# EAGLE design PDB2_1 (EAGLE 9.3.0)

## Sheet 1 of 3: BATTERY MANAGEMENT & OUTPUTS
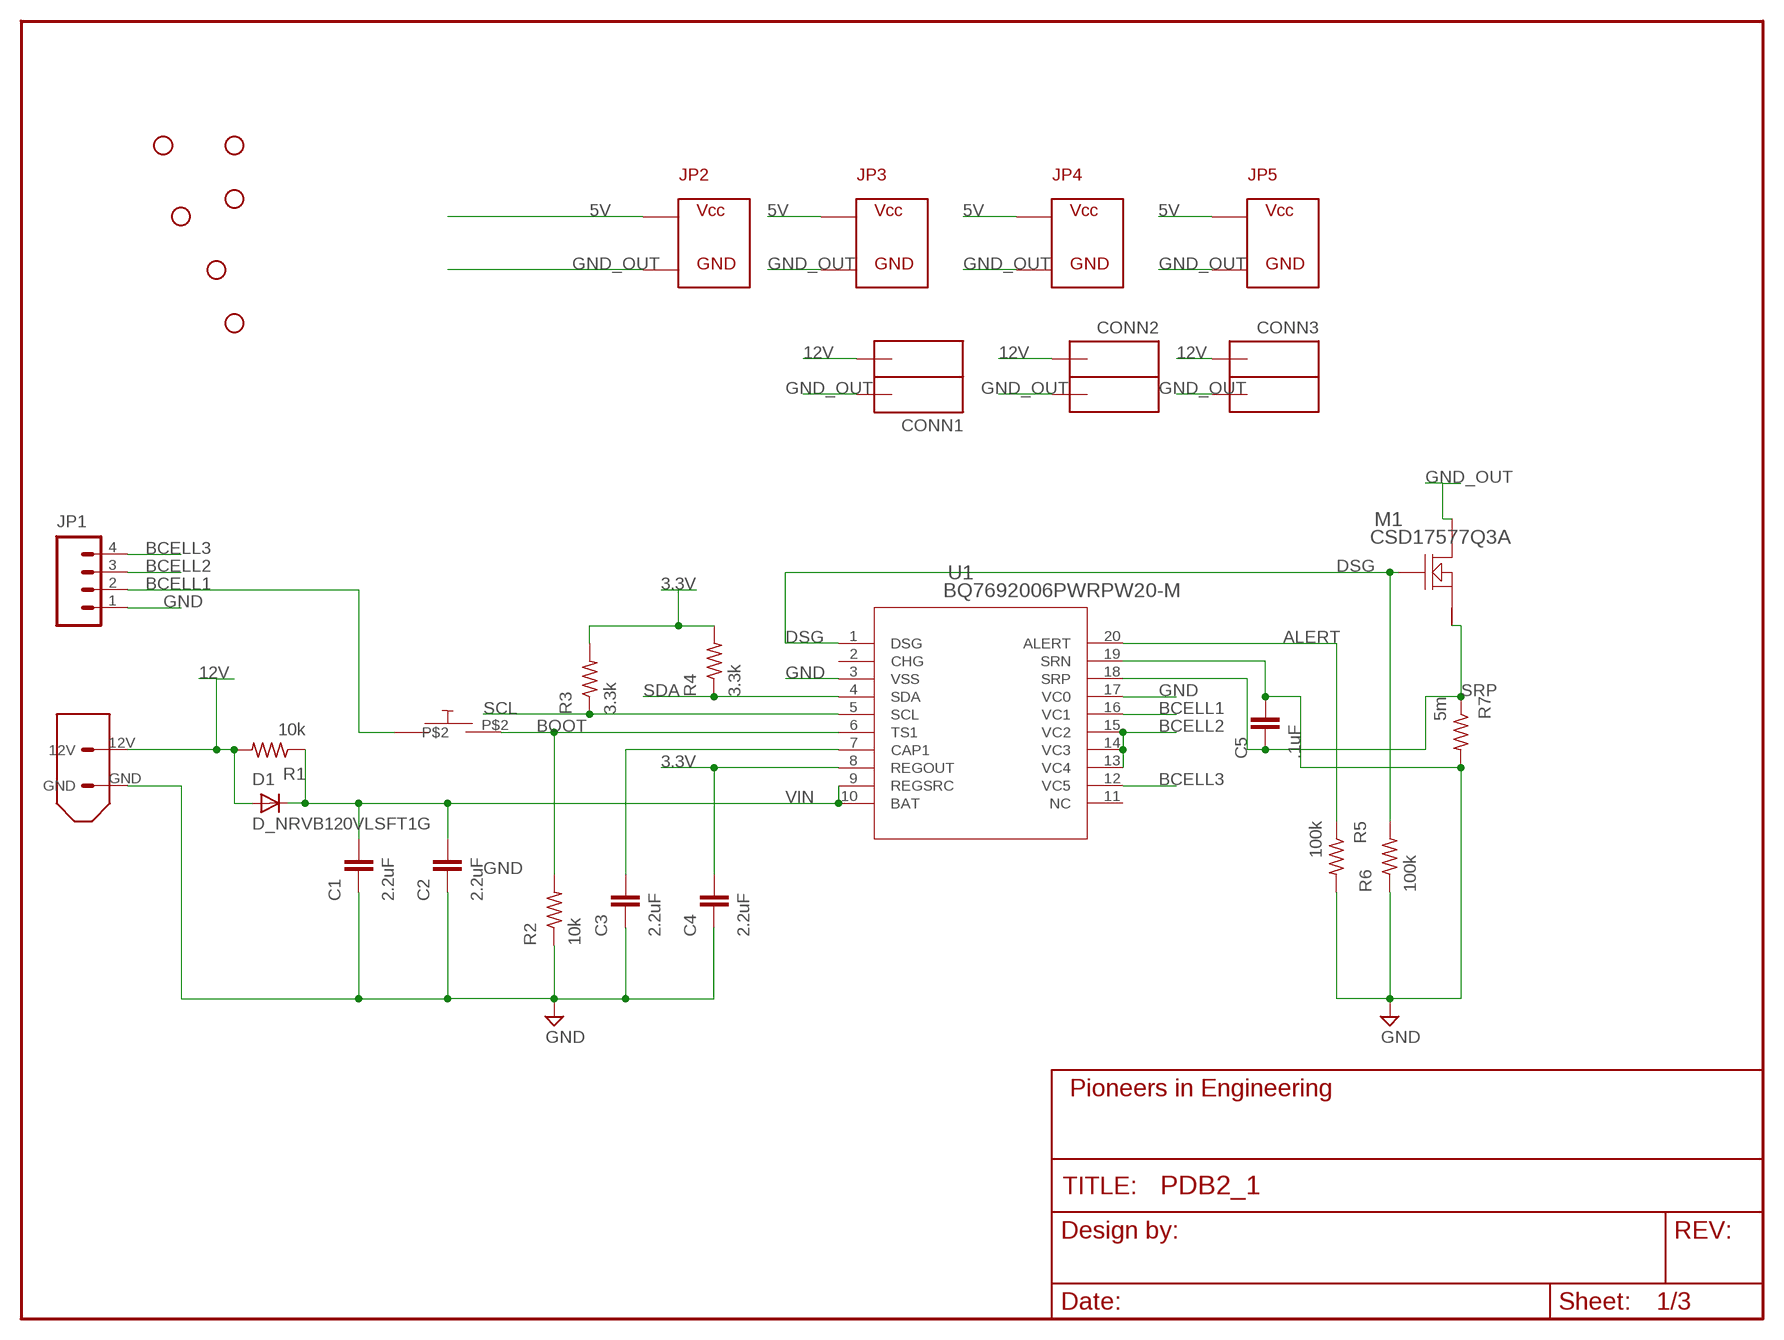
[diagram p0: schematic, sheet 1]
FRAME1 (FRAME_SCHEMATIC): AUTHOR: Sherwin A.

### Parts
C1  2.2uF  CAP0603-CAP  [0603-CAP]
C2  2.2uF  CAP0603-CAP  [0603-CAP]
C3  2.2uF  CAP0603-CAP  [0603-CAP]
C4  2.2uF  CAP0603-CAP  [0603-CAP]
C5  .1uF  CAP0603-CAP  [0603-CAP]
CONN1  ANDERSONVERTICAL  [ANDERSON_VERTICAL]
CONN2  ANDERSONVERTICAL  [ANDERSON_VERTICAL]
CONN3  ANDERSONVERTICAL  [ANDERSON_VERTICAL]
D1  D_NRVB120VLSFT1G  [ON_SEMI_SOD-123F]
J1  XT60CONNECTOR  [XT60CONNECTOR]
JP1  M041X04-MTA  [1X04-MTA]
JP2  ATX  [ATX]
JP3  ATX  [ATX]
JP4  ATX  [ATX]
JP5  ATX  [ATX]
M1  CSD17577Q3A  NMOS_CSD17579Q3A  [DNH0008A]
R1  10k  R-US_R0603  [R0603]
R2  10k  R-US_R0603  [R0603]
R3  3.3k  R-US_R0603  [R0603]
R4  3.3k  R-US_R0603  [R0603]
R5  100k  R-US_R0603  [R0603]
R6  100k  R-US_R0603  [R0603]
R7  5m  R-US_R2512  [R2512]
STANDOFF1  STAND-OFFTIGHT  [STAND-OFF-TIGHT]
STANDOFF2  STAND-OFFTIGHT  [STAND-OFF-TIGHT]
STANDOFF3  STAND-OFFTIGHT  [STAND-OFF-TIGHT]
STANDOFF4  STAND-OFFTIGHT  [STAND-OFF-TIGHT]
STANDOFF5  STAND-OFFTIGHT  [STAND-OFF-TIGHT]
STANDOFF6  STAND-OFFTIGHT  [STAND-OFF-TIGHT]
SW1  PUSH_BUTTON  [BUTTON_K12A]
U1  BQ7692006PWRPW20-M  [PW20-M]

### Nets
3.3V: C4.2 R3.2 R4.2 U1.8(REGOUT) ; also sheet 3
5V: JP2.P$1 JP3.P$1 JP4.P$1 JP5.P$1 ; also sheet 2
12V: CONN1.PIN1(OUTB) CONN2.PIN2(OUTA) CONN3.PIN2(OUTA) D1.P(A) J1.12V R1.2 ; also sheet 2
ALERT: R5.1 U1.20(ALERT) ; also sheet 3
BCELL1: JP1.2 SW1.P$1 U1.16(VC1)
BCELL2: JP1.3 U1.13(VC4) U1.14(VC3) U1.15(VC2)
BCELL3: JP1.4 U1.12(VC5)
BOOT: R2.2 SW1.P$2 U1.6(TS1) ; also sheet 3
CAP1: C3.2 U1.7(CAP1)
DSG: M1.4(GATE) R6.2 U1.1(DSG)
GND: C1.1 C2.1 C3.1 C4.1 C5.2 J1.GND JP1.1 R2.1 R5.2 R6.1 R7.2 U1.3(VSS) U1.17(VC0) U1.19(SRN) ; also sheet 3
GND_OUT: CONN1.PIN2(OUTA) CONN2.PIN1(OUTB) CONN3.PIN1(OUTB) JP2.P$2 JP3.P$2 JP4.P$2 JP5.P$2 M1.5(DRAIN_2) M1.6(DRAIN_2) M1.7(DRAIN_2) M1.8(DRAIN_2) M1.9(DRAIN_2) ; also sheet 2
SCL: R3.1 U1.5(SCL) ; also sheet 3
SDA: R4.1 U1.4(SDA) ; also sheet 3
SRP: C5.1 M1.1(SOURCE_2) M1.2(SOURCE_2) M1.3(SOURCE_2) R7.1 U1.18(SRP)
VIN: C1.2 C2.2 D1.N(C) R1.1 U1.9(REGSRC) U1.10(BAT)
Unconnected: U1.2(CHG) U1.11(NC)

## Sheet 2 of 3: VOLTAGE REGULATOR
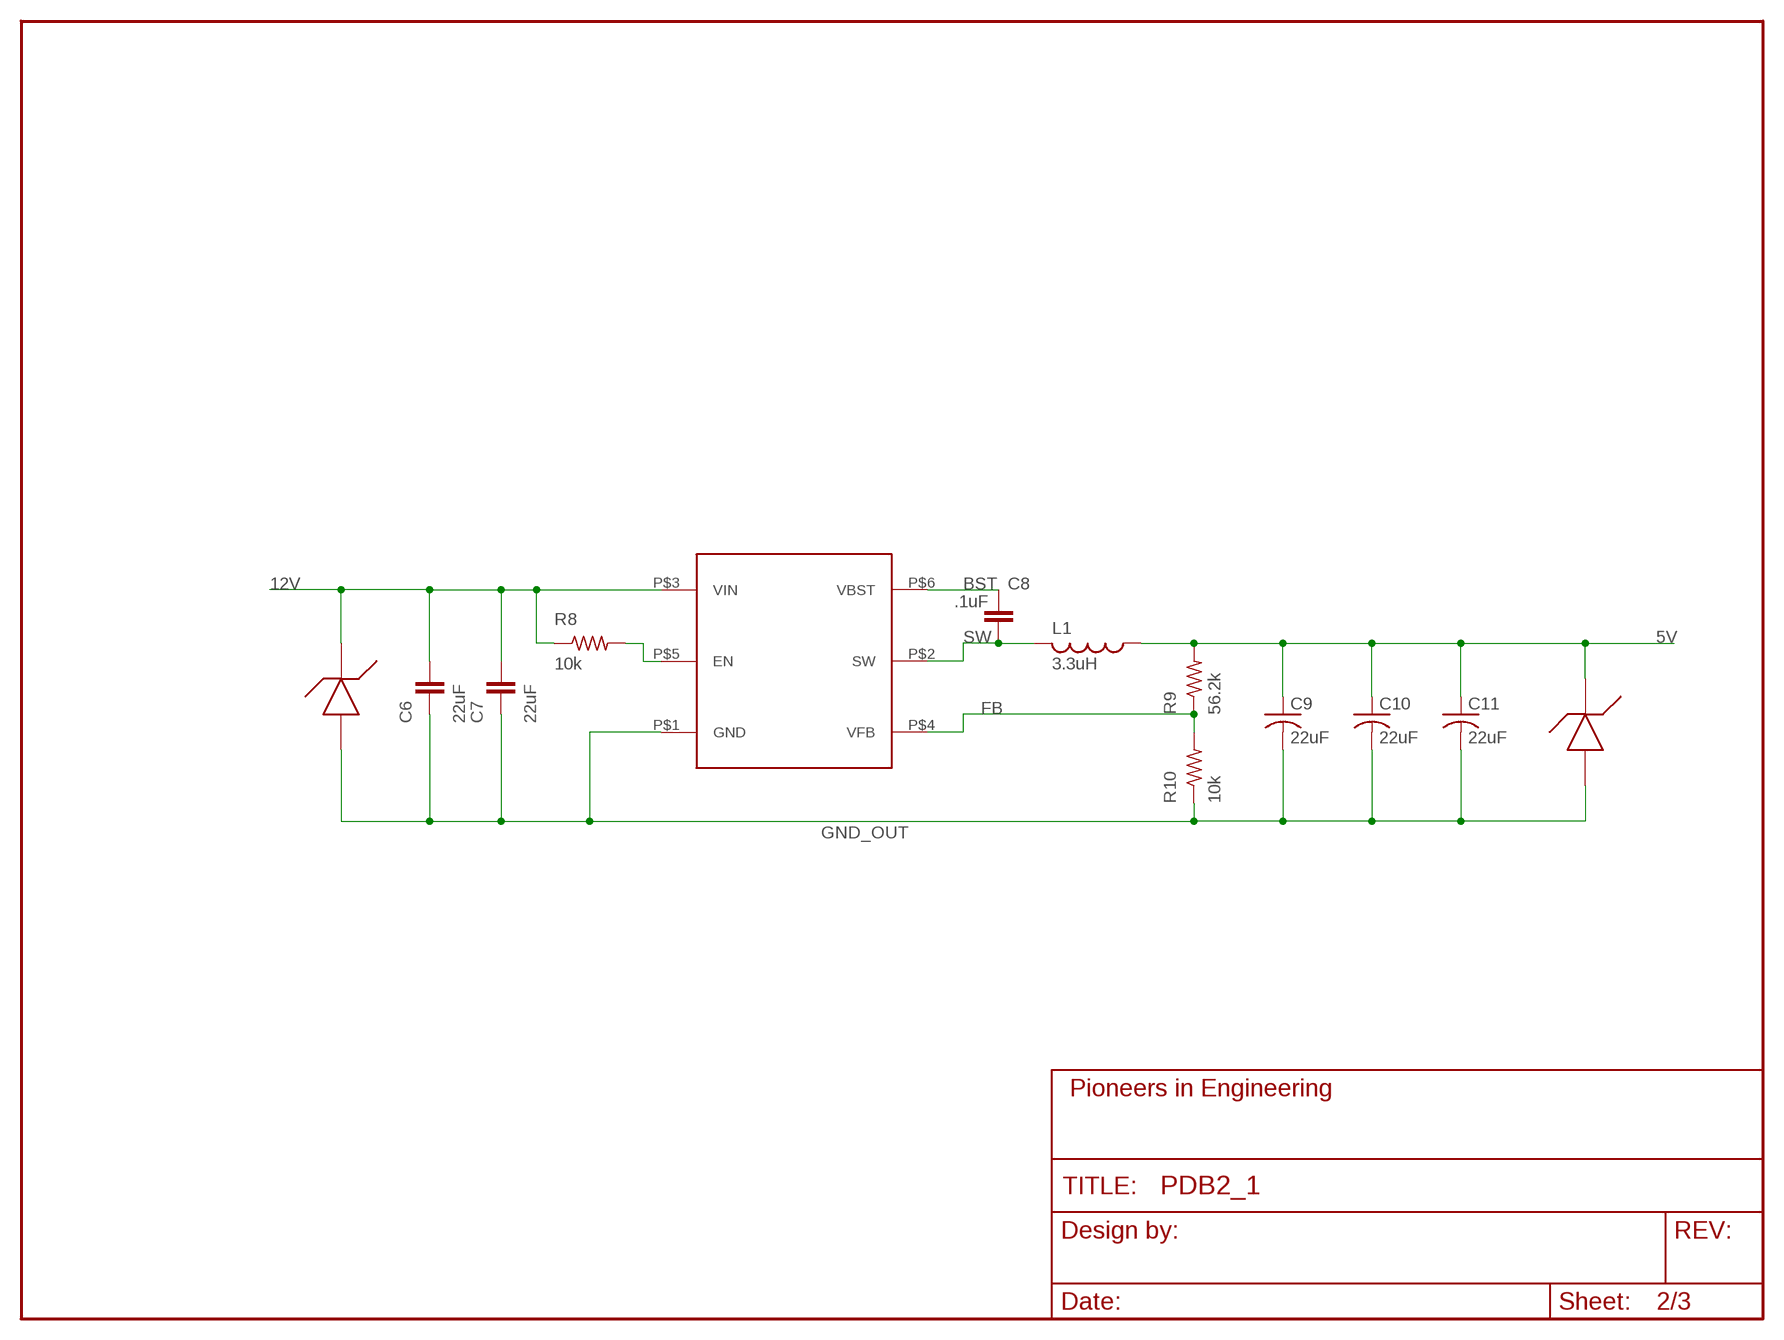
[diagram p1: schematic, sheet 2]

### Parts
C6  22uF  CAP0805  [0805]
C7  22uF  CAP0805  [0805]
C8  .1uF  CAP0603-CAP  [0603-CAP]
C9  22uF  C-USC0805  [C0805]
C10  22uF  C-USC0805  [C0805]
C11  22uF  C-USC0805  [C0805]
D2  BZT52C2VXX_ZENER  [SOD-123]
D3  BZT52C2VXX_ZENER  [SOD-123]
L1  3.3uH  MWSA0420S_INDUCTORMW  [MWSA0402S]
R8  10k  R-US_R0603  [R0603]
R9  56.2k  R-US_R0603  [R0603]
R10  10k  R-US_R0603  [R0603]
U2  TPS563200  [SOT-23_6PIN_COPY]

### Nets
5V: C9.1 C10.1 C11.1 D3.N L1.P$1 R9.2 ; also sheet 1
12V: C6.2 C7.2 D2.N R8.1 U2.P$3(VIN) ; also sheet 1
BST: C8.1 U2.P$6(VBST)
FB: R9.1 R10.2 U2.P$4(VFB)
GND_OUT: C6.1 C7.1 C9.2 C10.2 C11.2 D2.P D3.P R10.1 U2.P$1(GND) ; also sheet 1
N$27: R8.2 U2.P$5(EN)
SW: C8.2 L1.P$2 U2.P$2(SW)

## Sheet 3 of 3: DIGITAL INTERFACE
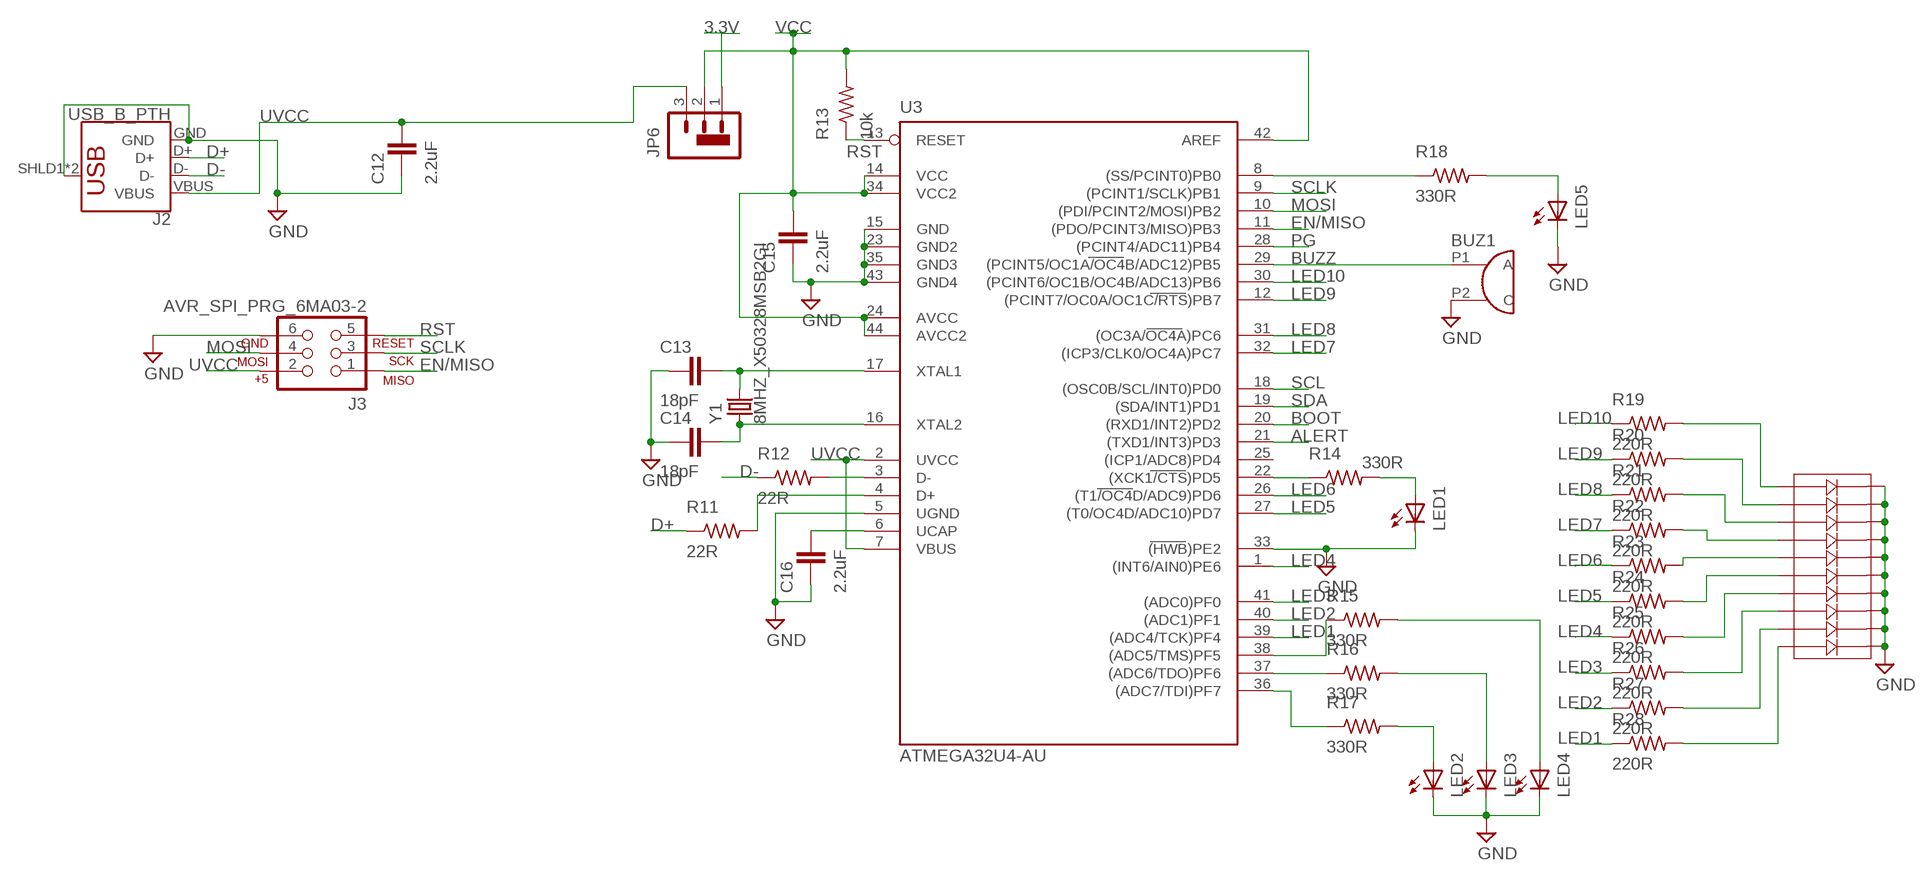
[diagram p2: schematic, sheet 3]

### Parts
BUZ1  BUZZER3.3VBUZZER  [BUZZER_3.3V]
C12  2.2uF  CAP0603-CAP  [0603-CAP]
C13  18pF  CAP0603-CAP  [0603-CAP]
C14  18pF  CAP0603-CAP  [0603-CAP]
C15  2.2uF  CAP0603-CAP  [0603-CAP]
C16  2.2uF  CAP0603-CAP  [0603-CAP]
J2  USB_B_PTH  [USB-B-PTH]
J3  AVR_SPI_PRG_6MA03-2  [MA03-2]
JP6  JMP-OPTION  [1X03-JMP-OPTION]
LED1  LED0805  [LED-0805]
LED2  LED0805  [LED-0805]
LED3  LED0805  [LED-0805]
LED4  LED0805  [LED-0805]
LED5  LED0805  [LED-0805]
LED6  BAR_SEGMENT_DISPLAY  [BAR_SEGMENT_DISPLAY]
R11  22R  R-US_R0603  [R0603]
R12  22R  R-US_R0603  [R0603]
R13  10k  R-US_R0603  [R0603]
R14  330R  R-US_R0603  [R0603]
R15  330R  R-US_R0603  [R0603]
R16  330R  R-US_R0603  [R0603]
R17  330R  R-US_R0603  [R0603]
R18  330R  R-US_R0603  [R0603]
R19  220R  R-US_R0603  [R0603]
R20  220R  R-US_R0603  [R0603]
R21  220R  R-US_R0603  [R0603]
R22  220R  R-US_R0603  [R0603]
R23  220R  R-US_R0603  [R0603]
R24  220R  R-US_R0603  [R0603]
R25  220R  R-US_R0603  [R0603]
R26  220R  R-US_R0603  [R0603]
R27  220R  R-US_R0603  [R0603]
R28  220R  R-US_R0603  [R0603]
U3  ATMEGA32U4-AU  [TQFP44]
Y1  8MHZ_X50328MSB2GI  [SMD-5032_2P]

### Nets
3.3V: JP6.1 ; also sheet 1
ALERT: U3.21((TXD1/INT3)PD3) ; also sheet 1
BOOT: U3.20((RXD1/INT2)PD2) ; also sheet 1
BUZZ: BUZ1.P1(A) U3.29((PCINT5/OC1A/OC4B/ADC12)PB5)
D+: J2.D+ R11.1
D-: J2.D- R12.1
EN/MISO: J3.1 U3.11((PDO/PCINT3/MISO)PB3)
GND: BUZ1.P2(C) C12.1 C13.1 C14.1 C15.1 C16.1 J2.GND J2.SHLD1(SHIELD) J2.SHLD2(SHIELD) J3.6 LED1.C LED2.C LED3.C LED4.C LED5.C LED6.BAR_DISPLAY10(P11) LED6.BAR_DISPLAY11(P12) LED6.BAR_DISPLAY12(P13) LED6.BAR_DISPLAY13(P14) LED6.BAR_DISPLAY14(P15) LED6.BAR_DISPLAY15(P16) LED6.BAR_DISPLAY16(P17) LED6.BAR_DISPLAY17(P18) LED6.BAR_DISPLAY18(P19) LED6.BAR_DISPLAY19(P20) U3.5(UGND) U3.15(GND) U3.23(GND2) U3.33((HWB)PE2) U3.35(GND3) U3.43(GND4) ; also sheet 1
LED1: R28.1 U3.39((ADC4/TCK)PF4)
LED2: R27.1 U3.40((ADC1)PF1)
LED3: R26.1 U3.41((ADC0)PF0)
LED4: R25.1 U3.1((INT6/AIN0)PE6)
LED5: R24.1 U3.27((T0/OC4D/ADC10)PD7)
LED6: R23.1 U3.26((T1/OC4D/ADC9)PD6)
LED7: R22.1 U3.32((ICP3/CLK0/OC4A)PC7)
LED8: R21.1 U3.31((OC3A/OC4A)PC6)
LED9: R20.1 U3.12((PCINT7/OC0A/OC1C/RTS)PB7)
LED10: R19.1 U3.30((PCINT6/OC1B/OC4B/ADC13)PB6)
MOSI: J3.4 U3.10((PDI/PCINT2/MOSI)PB2)
N$2: C13.2 U3.17(XTAL1) Y1.P$2
N$3: R12.2 U3.3(D-)
N$4: R11.2 U3.4(D+)
N$5: C14.2 U3.16(XTAL2) Y1.P$1
N$8: C16.2 U3.6(UCAP)
N$12: LED6.BAR_DISPLAY0(P1) R19.2
N$13: LED6.BAR_DISPLAY1(P2) R20.2
N$14: LED6.BAR_DISPLAY2(P3) R21.2
N$15: LED6.BAR_DISPLAY3(P4) R22.2
N$16: LED6.BAR_DISPLAY4(P5) R23.2
N$17: LED6.BAR_DISPLAY5(P6) R24.2
N$18: LED6.BAR_DISPLAY6(P7) R25.2
N$19: LED6.BAR_DISPLAY7(P8) R26.2
N$20: LED6.BAR_DISPLAY8(P9) R27.2
N$21: LED6.BAR_DISPLAY9(P10) R28.2
N$22: R18.1 U3.8((SS/PCINT0)PB0)
N$23: LED5.A R18.2
N$24: LED1.A R14.2
N$25: R14.1 U3.22((XCK1/CTS)PD5)
N$28: R17.1 U3.36((ADC7/TDI)PF7)
N$29: R16.1 U3.37((ADC6/TDO)PF6)
N$30: R15.1 U3.38((ADC5/TMS)PF5)
N$31: LED2.A R17.2
N$32: LED3.A R16.2
N$33: LED4.A R15.2
PG: U3.28((PCINT4/ADC11)PB4)
RST: J3.5 R13.1 U3.13(RESET)
SCL: U3.18((OSC0B/SCL/INT0)PD0) ; also sheet 1
SCLK: J3.3 U3.9((PCINT1/SCLK)PB1)
SDA: U3.19((SDA/INT1)PD1) ; also sheet 1
UVCC: C12.2 J2.VBUS J3.2 JP6.3 U3.2(UVCC) U3.7(VBUS)
VCC: C15.2 JP6.2(COMMON) R13.2 U3.14(VCC) U3.24(AVCC) U3.34(VCC2) U3.42(AREF) U3.44(AVCC2)
Unconnected: U3.25((ICP1/ADC8)PD4)

## Library data of the parts
BUZ1 = pie:BUZZER: Buzzer
C1-C8 C12-C16 = pie:CAP: Capacitor Standard 0603 ceramic capacitor, and 0.1" leaded capacitor.; PIE-INT-REF-NUM: CAPACITOR-GENERIC
C9-C11 = resistor:C-US: CAPACITOR, American symbol
CONN1-CONN3 = pie:ANDERSON: 2-pin 25A Anderson Connector http://www.alliedelec.com/images/products/datasheets/bm/ANDERSON_POWER_PRODUCTS/70162018.pdf; PIE-INT-REF-NUM: Anderson
D1 = pie:D_NRVB120VLSFT1G
D2 D3 = pie:BZT52C2VXX_ZENER
J1 = pie:XT60CONNECTOR: 12V XT60 power connector; PARTNUMBER: PRT-10474
J2 = SparkFun-Connectors:USB_B: USB Type B Connector SparkFun Products: SparkFun Stepoko <https://www.sparkfun.com/products/13899> PTH; PROD_ID: CONN-08278; SF_ID: PRT-00139
J3 = pie:AVR_SPI_PRG_6: AVR ISP 6 Pin This is the reduced ISP connector for AVR programming. Common on Arduino. This footprint will take up less PCB space and can be used with a 10-pin to 6-pin adapter such as SKU: BOB-08508; PIE-INT-REF-NUM: BULK-STOCK
JP1 = pie:M04: 4-pin 0.1-inch header and MTA connector; PIE-INT-REF-NUM: MTA
JP2-JP5 = pie:ATX: ATX 2 Pin Connector Crimper: http://www.digikey.com/product-detail/en/molex-llc/0640160204/WM17553-ND/2074099 Housing: http://www.digikey.com/product-detail/en/molex-llc/0019092029/WM4382-ND/2421313 Housing (alternative): http://www.digikey.com/product-detail/en/molex-llc/0015311026/WM1041-ND/313614 Connector: http://www.digikey.com/product-detail/en/molex-llc/0019091029/WM1602-ND/26354 Male crimps: http://www.digikey.com/product-detail/en/molex-llc/0002092103/WM1100-ND/26384 Female crimps: http://www.digikey.com/product-detail/en/molex-llc/0002091104/WM1101-ND/26386
JP6 = pie:JMP-OPTION: A 3 pin header with silk screen indicating jumper positions to select an option.
L1 = pie:MWSA0420S_INDUCTOR
LED1-LED5 = pie:LED: LEDs Standard schematic elements and footprints for 5mm, 3mm, 1206, and 0603 sized LEDs. 5mm - Spark Fun Electronics SKU : COM-00529 (and others); PIE-INT-REF-NUM: LED
LED6 = pie:BAR_SEGMENT_DISPLAY
M1 = pie:NMOS_CSD17579Q3A; MANUFACTURER_PART_NUMBER: CSD17577Q3A; VENDOR: Texas Instruments
R1-R6 R8-R28 = pie:R-US_: RESISTOR, American symbol; DESCRIPTION: RESISTOR, American symbol; DISTRIBUTOR: DigiKey; MANUFACTURER: Rohm Semiconductor; NOTES: Cut Tape; PACKAGE: R0603; VALUE: >VALUE
R7 = pie:R-US_: RESISTOR, American symbol; PIE-INT-REF-NUM: RESISTOR-GENERIC
STANDOFF1-STANDOFF6 = pie:STAND-OFF: #4 Stand Off This is the mechanical footprint for a #4 phillips button head screw. Use the keepout ring to avoid running the screw head into surrounding components. SKU : PRT-00447; PIE-INT-REF-NUM: DNL
SW1 = pie:PUSH_BUTTON
U1 = pie:BQ7692006PWR; MANUFACTURER_PART_NUMBER: BQ7692006PWR; VENDOR: Texas Instruments
U2 = pie:TPS563200
U3 = pie:ATMEGA32U4-AU; PIE-DIGIKEY-PN-ALT1: ATMEGA32U4-MURCT-ND; PIE-DIGIKEY-PN-PRI: ATMEGA32U4RC-MURCT-ND; PIE-INT-REF-NUM: ATmega32U4
Y1 = pie:8MHZ_X50328MSB2GI

## Board
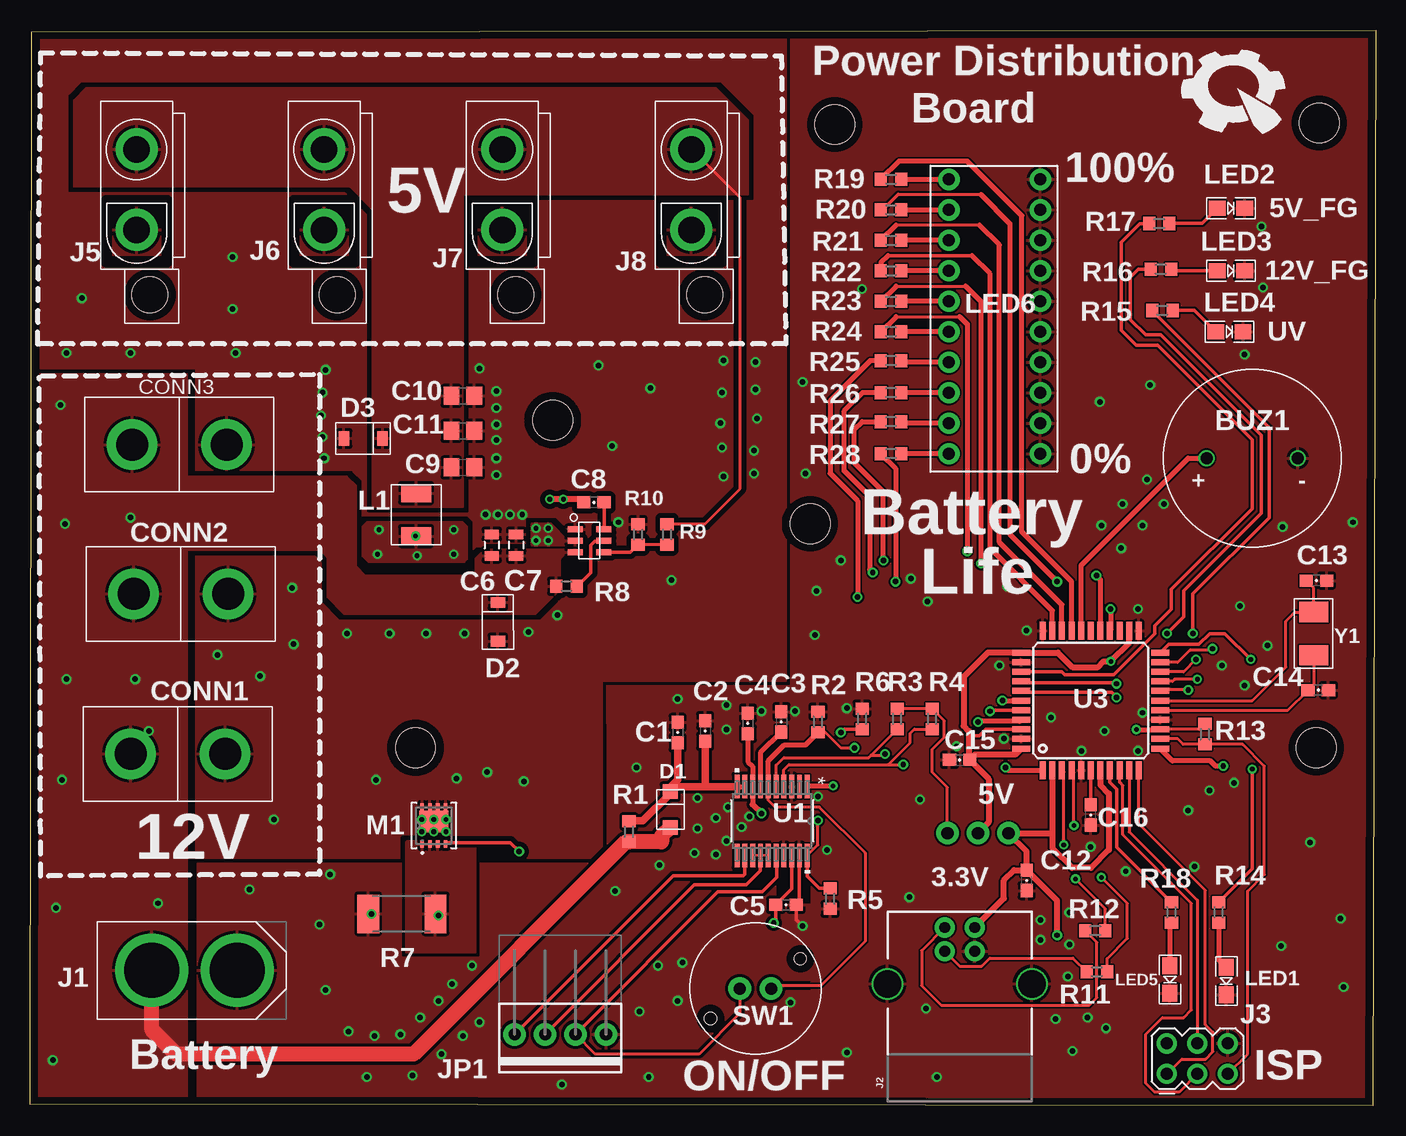
[diagram p3: board, top side]
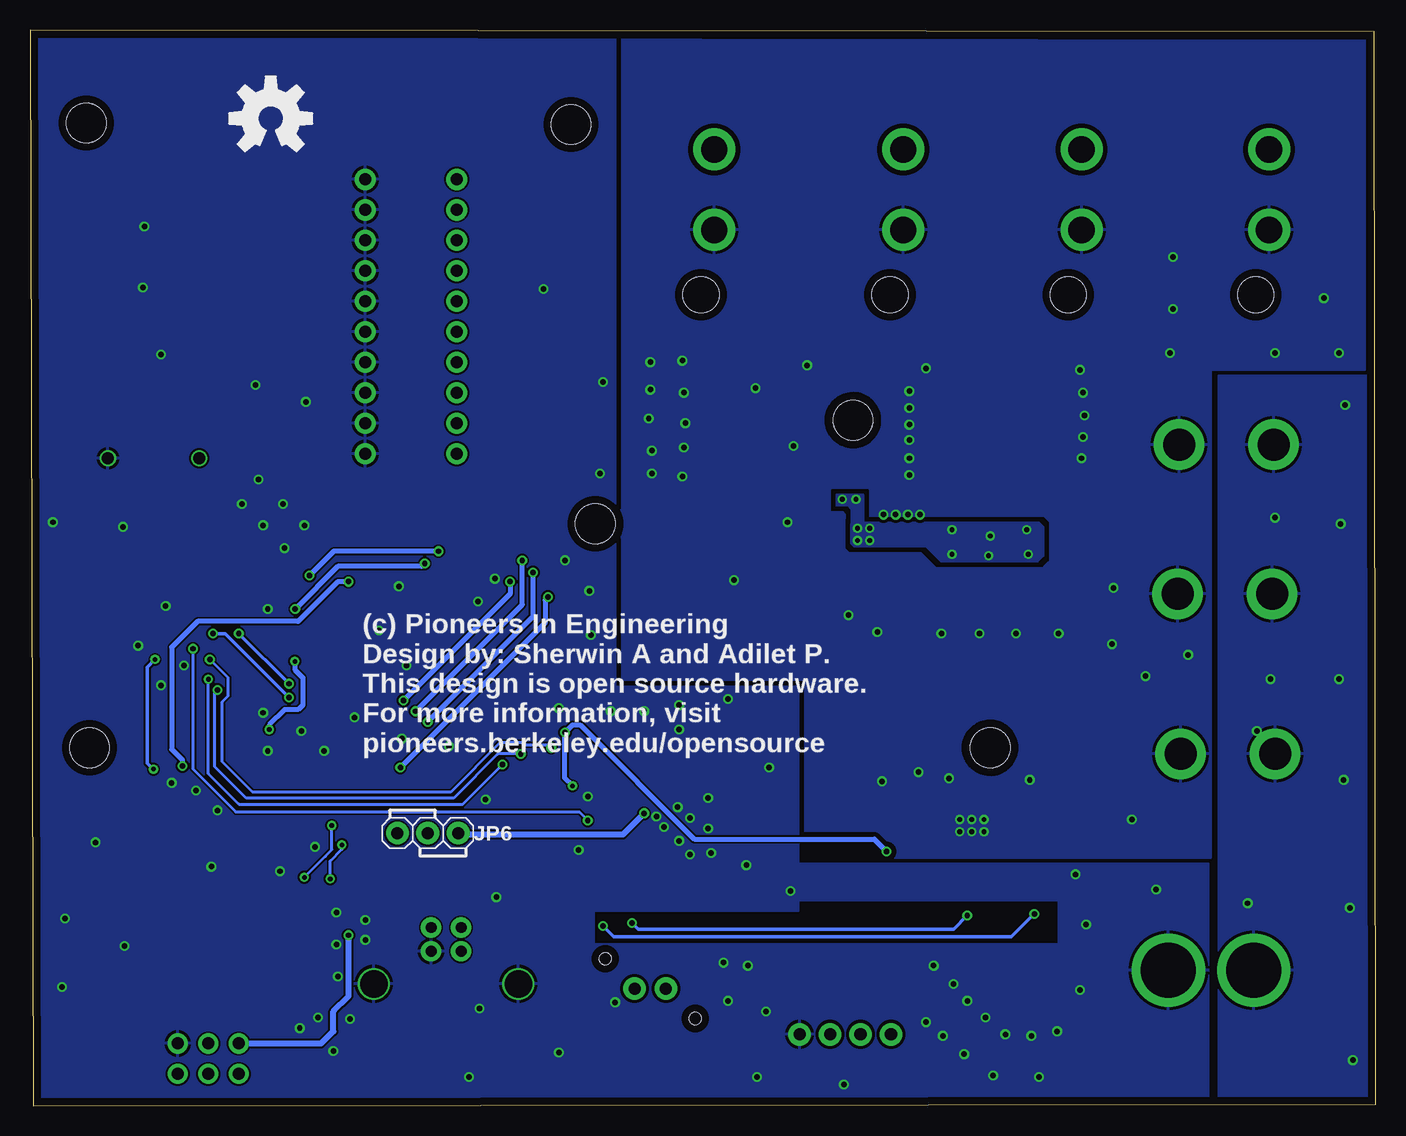
[diagram p4: board, bottom side, seen from below]

Size 112.14 x 89.66 mm. Coordinates in mm from the lower left corner, seen from the top.
Outline: 0,0.13 0.13,89.54 112.14,89.66 111.89,0 0,0.13
Copper layers (1*16): Top 2mil / dielectric 9mil / Bottom 2mil
Design rules "pie": minimum track width 6mil, minimum drill 15mil, track to track 6mil, track to pad 6mil, pad to pad 6mil, via to via 6mil, smd to smd 6mil, copper to edge 25mil, drill to drill 7mil, minimum pad ring 7mil, minimum via ring 7mil, stop-mask expansion 3mil, vias tented up to drill 21mil, thermal gap 10mil

### Footprints (pad centres in the part's own frame; a part is rotated, then mirrored left to right if it is on the bottom)
BUZZER_3.3V = drill 1: P1 -3.81,0; P2 3.79,0
0603-CAP = smd 1.1 x 1: 1 -0.85,0; 2 0.85,0
0805 = smd 0.8 x 1.2: 1 -0.9,0; 2 0.9,0
C0805 = smd 1.3 x 1.5: 1 -0.95,0; 2 0.95,0
ANDERSON_VERTICAL = drill 2.667 pad 4.191: PIN1 0,-3.937; PIN2 0,3.937
ON_SEMI_SOD-123F = smd 1.22 x 1.25: N -1.557,0; P 1.443,0
SOD-123 = smd 0.9 x 1.22: N -1.57,0; P 1.65,0
XT60CONNECTOR = drill 4.572 pad 6.096: 12V -3.556,0; GND 3.556,0
USB-B-PTH = drill 0.914 pad 1.676: D+ 4,1.25; D- 5.981,1.25; GND 4,-1.25; VBUS 5.981,-1.25 | drill 2.286: SHLD1 1.282,-6.02; SHLD2 1.282,6.02
MA03-2 = drill 1 pad 1.676: 1 -2.54,-1.27; 2 -2.54,1.27; 3 0,-1.27; 4 0,1.27; 5 2.54,-1.27; 6 2.54,1.27
1X04-MTA = drill 1.016 pad 1.88: 1 -3.81,0; 2 -1.27,0; 3 1.27,0; 4 3.81,0
ATX = drill 2.2 pad 3.5: P$1 -3,0; P$2 3.7,0 | hole 3: 9.1,1.1
1X03-JMP-OPTION = drill 1.016 pad 1.88: 1 -2.54,0; 2 0,0; 3 2.54,0
MWSA0402S = smd 1.5 x 2.5: P$1 -1.8,-0.2; P$2 1.8,-0.2
LED-0805 = smd 1.397 x 1.245: A -1.143,0; C 1.143,0
BAR_SEGMENT_DISPLAY = drill 1 pad 1.778: BAR_DISPLAY0 -3.429,9.652; BAR_DISPLAY1 -3.429,7.112; BAR_DISPLAY2 -3.429,4.572; BAR_DISPLAY3 -3.429,2.032; BAR_DISPLAY4 -3.429,-0.508; BAR_DISPLAY5 -3.429,-3.048; BAR_DISPLAY6 -3.429,-5.588; BAR_DISPLAY7 -3.429,-8.128; BAR_DISPLAY8 -3.429,-10.668; BAR_DISPLAY9 -3.429,-13.208; BAR_DISPLAY10 4.191,-13.208; BAR_DISPLAY11 4.191,-10.668; BAR_DISPLAY12 4.191,-8.128; BAR_DISPLAY13 4.191,-5.588; BAR_DISPLAY14 4.191,-3.048; BAR_DISPLAY15 4.191,-0.508; BAR_DISPLAY16 4.191,2.032; BAR_DISPLAY17 4.191,4.572; BAR_DISPLAY18 4.191,7.112; BAR_DISPLAY19 4.191,9.652
DNH0008A = smd 0.61 x 0.305: 1 -1.55,0.975; 2 -1.55,0.325; 3 -1.55,-0.325; 4 -1.55,-0.975 | smd 0.635 x 0.305: 5 1.55,-0.975; 6 1.55,-0.325; 7 1.55,0.325; 8 1.55,0.975 | smd 1.778 x 2.438: 9 0.343,0
R0603 = smd 1 x 1.1: 1 -0.85,0; 2 0.85,0
R2512 = smd 1.8 x 3.2: 1 -2.8,0; 2 2.8,0
STAND-OFF-TIGHT = hole 3.302: 0,0
BUTTON_K12A = drill 1 pad 1.88: P$1 -1.308,0; P$2 1.303,0 | hole 1: -3.747,-2.489; 3.747,2.489
PW20-M = smd 1.981 x 0.406: 1 -2.87,2.925; 2 -2.87,2.275; 3 -2.87,1.625; 4 -2.87,0.975; 5 -2.87,0.325; 6 -2.87,-0.325; 7 -2.87,-0.975; 8 -2.87,-1.625; 9 -2.87,-2.275; 10 -2.87,-2.925; 11 2.87,-2.925; 12 2.87,-2.275; 13 2.87,-1.625; 14 2.87,-0.975; 15 2.87,-0.325; 16 2.87,0.325; 17 2.87,0.975; 18 2.87,1.625; 19 2.87,2.275; 20 2.87,2.925
SOT-23_6PIN_COPY = smd 0.5 x 1.25: P$1 0.6,-0.3; P$2 1.55,-0.3; P$3 2.5,-0.3; P$4 2.5,2.1; P$5 1.55,2.1; P$6 0.6,2.1
TQFP44 = smd 1.5 x 0.5: 1 -5.8,4; 2 -5.8,3.2; 3 -5.8,2.4; 4 -5.8,1.6; 5 -5.8,0.8; 6 -5.8,0; 7 -5.8,-0.8; 8 -5.8,-1.6; 9 -5.8,-2.4; 10 -5.8,-3.2; 11 -5.8,-4; 23 5.8,-4; 24 5.8,-3.2; 25 5.8,-2.4; 26 5.8,-1.6; 27 5.8,-0.8; 28 5.8,0; 29 5.8,0.8; 30 5.8,1.6; 31 5.8,2.4; 32 5.8,3.2; 33 5.8,4 | smd 0.5 x 1.5: 12 -4,-5.8; 13 -3.2,-5.8; 14 -2.4,-5.8; 15 -1.6,-5.8; 16 -0.8,-5.8; 17 0,-5.8; 18 0.8,-5.8; 19 1.6,-5.8; 20 2.4,-5.8; 21 3.2,-5.8; 22 4,-5.8; 34 4,5.8; 35 3.2,5.8; 36 2.4,5.8; 37 1.6,5.8; 38 0.8,5.8; 39 0,5.8; 40 -0.8,5.8; 41 -1.6,5.8; 42 -2.4,5.8; 43 -3.2,5.8; 44 -4,5.8
SMD-5032_2P = smd 1.7 x 2.4: P$1 -1.8,0; P$2 1.8,0

### Placement (x,y rotation side)
BUZ1  101.85,53.97 0 top
C1  53.97,31.12 270 top
C2  56.26,31.24 270 top
C3  62.61,32 270 top
C4  59.82,31.88 270 top
C5  62.99,16.76 0 top
C6  38.48,46.74 270 top
C7  40.51,46.74 270 top
C8  46.99,50.29 180 top
C9  36.07,53.21 0 top
C10  36.07,59.18 0 top
C11  36.07,56.26 0 top
C12  83.06,18.8 90 top
C13  107.2,43.78 180 top
C14  107.36,34.66 180 top
C15  77.47,28.83 0 top
C16  88.39,24.26 90 top
CONN1  12.32,29.34 270 top
CONN2  12.57,42.67 90 top
CONN3  12.45,55.12 90 top
D1  53.34,24.64 270 top
D2  38.99,40.39 270 top
D3  27.81,55.63 180 top
J1  13.72,11.3 0 top
J2  77.47,8.89 90 top
J3  97.28,3.94 0 top
JP1  44.2,5.97 180 top
JP2  55.12,76.71 270 top
JP3  8.89,76.71 270 top
JP4  39.37,76.71 270 top
JP5  24.51,76.71 270 top
JP6  78.99,22.73 180 bottom
L1  32.38,49.28 270 top
LED1  99.7,10.41 270 top
LED2  100.08,74.8 0 top
LED3  100.08,69.6 0 top
LED4  99.95,64.52 0 top
LED5  95,10.54 270 top
LED6  80.01,67.56 0 top
M1  33.65,23.37 90 top
R1  49.91,22.86 270 top
R2  65.66,32 270 top
R3  72.26,32.26 90 top
R4  75.18,32.26 90 top
R5  66.68,17.27 270 top
R6  69.34,32.26 270 top
R7  30.99,16 180 top
R8  44.7,43.31 0 top
R9  53.09,47.62 90 top
R10  50.67,47.62 270 top
R11  88.9,11.18 0 top
R12  88.77,14.61 0 top
R13  97.92,30.99 90 top
R14  99.06,16.13 270 top
R15  94.36,66.29 0 top
R16  94.23,69.72 0 top
R17  94.11,73.53 0 top
R18  95.12,16.13 270 top
R19  71.76,77.22 0 top
R20  71.76,74.68 0 top
R21  71.76,72.14 0 top
R22  71.76,69.6 0 top
R23  71.76,67.06 0 top
R24  71.76,64.52 0 top
R25  71.76,62.1 0 top
R26  71.76,59.44 0 top
R27  71.76,57.02 0 top
R28  71.76,54.36 0 top
STANDOFF1  32.13,29.85 0 top
STANDOFF2  107.19,29.85 0 top
STANDOFF3  67.06,81.79 0 top
STANDOFF4  107.44,81.92 0 top
STANDOFF5  43.56,57.15 0 top
STANDOFF6  65.02,48.51 0 top
SW1  60.45,9.78 0 top
U1  61.85,23.75 270 top
U2  45.72,48.64 270 top
U3  88.39,33.78 90 top
U$1  [PIE-LOGO-SMALL]  100.58,84.84 0 top
U$2  [OSHW-LOGO-L]  92.08,82.3 0 bottom
Y1  106.97,39.35 90 top

### Tracks (layer width: path | path; a pad name or v marks a point on that pad's centre or on a via)
3.3V  (via drill 0.46 pad 0.76)
  Top 0.254: R3.2 R4.2 76.2,32.09 76.2,30.73 75.18,29.72 75.18,27.81 76.45,26.54 JP6.1
  Top 0.406: C4.2 59.82,28.7 60.22,28.3 U1.8 60.22,25.12
  Top 0.508: 60.22,25.12 v60.96,24.38
  Bottom 0.508: v60.96,24.38 62.74,22.61 76.33,22.61 JP6.1
5V
  Top 0.254: R9.2 53.12,48.51 56.26,48.51 59.18,51.43 59.18,75.69 55.17,79.71 JP2.P$1
  pour Top (isolate 0.254): 28.58,49.91 28.58,74.68 26.67,76.58 3.68,76.58 3.68,83.82 4.7,84.84 57.15,84.84 59.82,82.17 59.82,75.95 36.06,75.95 36.06,53.59 36.07,53.59 36.07,49.91
12V  (via drill 0.46 pad 0.76)
  Top 1.27: J1.12V 10.16,6.35 12.19,4.32 31.96,4.32 49.66,22.01 R1.2 52.64,22.01 52.64,22.5 D1.P
  other vias: 1.91,3.81 2.16,16.51 2.67,27.18 3.05,35.56 9.91,31.24 10.67,16.89 8.76,35.56 2.92,48.51 8.38,49.02 2.54,58.42
  pour Top (isolate 0.254, rank 2): -3.3,60.96 -3.3,-2.03 13.08,-2.03 13.08,60.96
  pour Bottom (isolate 0.254, rank 2): -3.94,60.83 13.08,60.83 13.08,-2.29 -3.94,-2.29
  pour Top: 12.19,52.45 12.19,46.74 12.57,46.35 24.13,46.35 24.77,45.72 24.77,42.42 26.16,41.02 42.16,41.02 44.2,43.05 44.2,45.59 44.58,45.97 45.72,45.97 45.72,46.35 37.85,46.35 37.08,45.59 37.08,44.2 27.94,44.2 27.18,44.96 27.18,51.69 26.42,52.45
ALERT  (via drill 0.45 pad 0.76)
  Top 0.254: U1.20 65.66,21.76 v65.66,23.8 | v98.55,38.1 98.43,37.97 96.65,37.97 95.63,36.96 94.22,36.96 U3.21
  Top 0.305: U1.20 64.77,19.13 65.79,18.12 R5.1
  Bottom 0.254: v65.66,23.8 66.37,24.51 95,24.51 98.55,28.07 v98.55,38.1
BCELL1
  Top 0.254: SW1.P$1 59.14,7.71 55.75,4.32 47.12,4.32 JP1.2
  Top 0.305: JP1.2 57.33,17.83 61.01,17.83 62.23,19.05 62.23,20.82 U1.16
BCELL2
  Top 0.203: U1.13 U1.14 U1.15
  Top 0.305: JP1.3 55.37,18.42 59.69,18.42 60.87,19.6 U1.14
BCELL3
  Top 0.305: JP1.4 53.59,19.18 59.44,19.18 59.57,19.32 U1.12
BOOT  (via drill 0.45 pad 0.76)
  Top 0.254: U1.6 61.52,25.47 62.1,24.89 65.79,24.89 69.6,21.08 69.6,13.72 65.91,10.03 62.01,10.03 SW1.P$2 | R2.2 66.26,31.15 67.56,29.85 v68.71,29.85 | v97.16,37.21 96.13,36.18 U3.20
  Top 0.406: U1.6 61.52,28.76 62.86,30.1 64.64,30.1 65.66,31.12 R2.2
  Bottom 0.254: v68.71,29.85 68.96,30.1 71.04,30.1 71.22,30.27 72.98,30.27 77.09,26.16 93.6,26.16 96.11,28.68 96.11,33.68 95.63,34.16 95.63,35.69 v97.16,37.21
BST
  Top 0.152: U2.P$6 47.82,47.98 47.84,47.96
  Top 0.305: 47.84,47.96 C8.1
BUZZ
  Top 0.406: U3.29 87.59,45.05 96.52,53.97 BUZ1.P1
CAP1
  Top 0.406: C3.2 60.87,29.42 U1.7
D+
  Top 0.254: J2.D+ 77.47,11.64 79.31,11.64 79.98,12.32 86.91,12.32 R11.1
D-
  Top 0.254: J2.D- 74.3,12.95 74.3,10.03 75.95,8.38 88.27,8.38 88.9,9.02 88.9,13.63 R12.1
DSG  (via drill 0.38 pad 0.76, 0.46 pad 0.76)
  Top 0.305: R6.2 67.86,31.41 v67.56,31.12 | v40.77,21.21 40.03,21.95 34.76,21.95 M1.4
  Top 0.406: U1.1 64.83,26.67 v66.93,26.67
  Bottom 0.406: v66.93,26.67 67.56,27.3 v67.56,31.12 66.93,31.75 66.29,31.75 56.77,22.23 41.78,22.23 v40.77,21.21
EN/MISO
  Top 0.254: J3.1 95.99,3.91 97.97,3.91 98.58,4.52 98.58,6.15 97.94,6.78 97.94,17.96 92.38,23.52 92.38,27.71 92.39,27.73 U3.11
FB
  Top 0.254: R9.1 R10.2
  Top 0.305: U2.P$4 50.04,46.14 R10.2
GND  (via drill 0.45 pad 0.76, 0.46 pad 0.76)
  Top 0.305: v64.39,14.99 63.84,15.53 C5.2 64.12,17.05 U1.19
  Bottom 0.305: v28.45,16 30.35,14.1 63.5,14.1 v64.39,14.99
  other vias: 18.29,18.03 25.02,19.3 24.13,15.11 24.64,9.65 36.83,11.68 35.18,10.16 34.04,8.76 32.51,7.37 30.86,5.97 28.7,5.84 26.54,6.22 28.07,2.41 31.88,2.54 34.29,4.32 36.07,5.84 37.46,6.98 48.77,17.91 52.32,11.68 44.32,1.78 51.56,2.41 50.8,7.87 53.97,8.76 54.36,11.94 63.37,8.64 68.07,4.45 75.56,2.41 57.15,24 57.15,20.96 65.66,25.78 50.55,28.19 53.97,33.91 91.31,19.56 93.34,60.07 89.28,48.39 89.15,58.67 69.34,68.07 64.39,60.32 64.64,52.7 67.56,45.47 65.53,42.93 65.41,39.24 55.63,25.65 55.37,21.08 52.45,20.07 59.94,24.13 59.31,23.24 58.04,22.1 58.17,24.89 55.63,23.11 66.42,21.34 73.28,17.4 109.47,9.91 104.27,13.33 97.03,19.94 109.22,15.62 87.63,29.59 89.54,31.24 81.15,30.61 85.09,32.38 92.33,29.59 96.52,24.64 98.3,26.29 100.33,26.92 101.22,35.05 103.12,38.35 100.84,41.66 99.31,36.7 104.39,48.26 90.93,46.48 92.71,48.39 94.49,50.16 91.06,50.16 93.09,52.2 81.41,43.31 83.06,39.62 73.41,43.94 74.8,42.04 80.77,36.7 74.17,25.53 58.04,31.37 58.04,33.4 60.96,32.89 63.75,32.89 88.39,21.59 74.68,8.13 68.07,33.15 77.22,29.97 86.87,4.57 110.24,48.64 92.33,41.4 92.71,32.77 101.22,62.61 102.74,68.2 102.62,73.28 84.2,15.49 84.2,13.84 86.61,16.13 86.61,13.46 86.49,10.79 85.47,7.24 88.14,7.37 89.66,6.48 106.68,21.97
  pour Bottom: 65.15,-2.92 115.82,-2.92 115.82,89.79 63.37,89.79 63.37,34.92 48.13,34.92 48.13,16.26 65.15,16.26 65.15,-2.92
  pour Bottom (isolate 0.254, rank 2): 13.97,-3.17 65.79,-3.17 65.79,13.46 26.42,13.46 26.42,20.19 13.97,20.19
  pour Top (isolate 0.254, rank 2): 13.97,-3.56 65.53,-3.56 65.53,16.76 62.1,16.76 62.1,21.08 62.23,21.08 62.23,34.92 48.13,34.92 48.13,20.19 13.97,20.19
  pour Top (rank 2): 113.54,-3.56 65.15,-3.56 65.15,21.72 61.85,21.72 61.85,34.8 63.5,34.8 63.5,89.79 113.54,89.79
  pour Bottom (rank 2): 24.13,20.19 24.13,17.14 48.89,17.14 48.89,20.19
  pour Top (isolate 0.254, rank 3): -0.51,89.92 64.01,89.92 64.01,31.88 24.26,31.88 24.26,60.71 13.84,60.71 13.84,61.47 -0.51,61.47
GND_OUT  (via drill 0.4 pad 0.76, 0.46 pad 0.76)
  other vias: 21.84,43.18 35.56,27.3 38.1,27.81 20.32,23.88 15.62,37.59 19.18,35.81 21.97,38.48 4.32,67.31 3.05,62.74 8.38,62.74 17.14,62.74 16.89,66.42 16.89,70.74 38.86,59.56 37.46,61.47 38.86,58.17 38.86,56.77 38.86,55.5 51.69,59.82 47.37,61.72 48.51,54.99 38.86,53.97 38.86,52.58 37.97,49.28 38.99,49.28 40,49.28 41.02,49.28 49.02,48.64 57.78,52.45 57.66,54.86 57.53,56.9 57.66,59.44 57.78,62.1 60.45,61.98 60.45,59.69 60.58,57.28 60.32,54.61 60.32,52.7 53.47,43.81 43.94,40.89 41.53,39.5 36.2,39.37 33.02,39.37 29.97,39.37 26.42,39.37 41.15,27.05 28.83,27.18 32.64,23.88 33.65,23.88 34.67,23.88 33.65,22.86 32.64,22.86 34.67,22.86 24.64,61.34 24.38,59.44 24.26,57.53 24.38,55.75 24.51,53.97
  pour Bottom (isolate 0.406, rank 2): 47.75,20.7 13.72,20.7 13.72,61.34 0.89,61.34 0.89,88.9 62.99,88.9 62.99,35.31 47.62,35.31 47.62,26.8 47.75,26.67
  pour Top (isolate 0.406, rank 2): 47.62,20.7 13.84,20.7 13.84,61.47 0.89,61.47 0.89,89.28 62.99,89.28 62.99,35.43 47.62,35.43
LED1  (via drill 0.45 pad 0.76)
  Top 0.406: R28.1 72.14,53.12 v72.14,43.69 | v81.03,33.78 U3.39
  Bottom 0.406: v72.14,43.69 72.14,42.67 v81.03,33.78
LED2  (via drill 0.45 pad 0.76)
  Top 0.305: U3.40 80.1,32.98
  Top 0.406: 80.1,32.98 v80.01,32.89 | v71.12,45.47 71.12,51.18 68.71,53.59 68.71,56.39 69.34,57.02 R27.1
  Bottom 0.406: v80.01,32.89 71.12,41.78 v71.12,45.47
LED3  (via drill 0.45 pad 0.76)
  Top 0.406: R26.1 69.38,59.44 67.82,57.87 67.82,52.96 69.98,50.8 69.98,44.7 v70.23,44.45 | v78.99,32 79.05,32.05 82.47,32.05 U3.41
  Bottom 0.406: v70.23,44.45 70.23,40.77 v78.99,32
LED4  (via drill 0.45 pad 0.76)
  Top 0.406: R25.1 70.02,62.1 66.68,58.76 66.68,52.7 68.96,50.42 v68.96,42.42 | v81.28,28.19 81.49,27.98 U3.1
  Bottom 0.406: v68.96,42.42 69.22,42.16 69.22,40.26 v81.28,28.19
LED5  (via drill 0.45 pad 0.76)
  Top 0.254: 72.18,65.79 77.47,65.79
  Top 0.406: R24.1 72.18,65.79 | v88.86,44.2 89.19,43.86 U3.27 | 77.47,65.79 78.11,65.15 v78.11,46.23
  Bottom 0.406: v78.11,46.23 86.83,46.23 v88.86,44.2
LED6  (via drill 0.45 pad 0.76)
  Top 0.254: 72.18,68.33 77.98,68.33
  Top 0.406: R23.1 72.18,68.33 | 77.98,68.33 79.25,67.06 v79.25,45.21 | v90.04,41.4 90.04,39.63 U3.26
  Bottom 0.406: v79.25,45.21 79.5,44.96 86.49,44.96 v90.04,41.4
LED7
  Top 0.305: 78.49,70.87 71.5,70.87
  Top 0.406: U3.32 85.19,41.27 80.01,46.45 80.01,69.34 78.49,70.87 | R22.1 70.91,70.27 71.5,70.87
LED8
  Top 0.254: 79.12,73.41 72.18,73.41
  Top 0.406: U3.31 85.99,41.77 80.77,46.99 80.77,71.76 79.12,73.41 | 72.18,73.41 R21.1
LED9  (via drill 0.45 pad 0.76)
  Top 0.254: 72.34,75.96 79.23,75.96
  Top 0.305: 71.05,74.68 72.34,75.96
  Top 0.406: R20.1 71.05,74.68 | 79.23,75.96 81.66,73.53 81.66,47.62 v85.6,43.69 | v99.44,28.32 98.81,28.32 98.36,28.77 95.21,28.77 U3.12
  Bottom 0.406: v85.6,43.69 86.49,43.69 89.79,40.39 98.17,40.39 100.33,38.23 100.33,29.72 99.44,28.83 v99.44,28.32
LED10
  Top 0.406: U3.30 86.79,43.7 82.66,47.84 82.66,74.19 78.11,78.74 72.43,78.74 R19.1
MOSI
  Top 0.254: U3.10 91.59,22.84 97.28,17.14 J3.4
N$2
  Top 0.254: U3.17 101.85,33.78 104.65,36.58 104.65,40.39 105.42,41.15 Y1.P$2 106.97,43.16 C13.2
N$3  (via drill 0.38 pad 0.76)
  Top 0.254: v86.15,21.76 86.15,27.83 U3.3 | R12.2 89.62,16.42 v87.12,18.92
  Bottom 0.254: v87.12,18.92 87.12,20.41 86.15,21.38 v86.15,21.76
N$4  (via drill 0.38 pad 0.76)
  Top 0.254: v87,23.37 87,27.78 U3.4 | R11.2 89.75,12.28 91.44,13.97 91.44,16.89 v89.28,19.05
  Bottom 0.254: v89.28,19.05 87.53,20.8 87.53,20.83 87,21.36 v87,23.37
N$5
  Top 0.254: U3.16 104.83,32.98 C14.2 106.97,35.12 Y1.P$1
N$8
  Top 0.305: C16.2 U3.6
N$12
  Top 0.406: R19.2 LED6.BAR_DISPLAY0
N$13
  Top 0.406: R20.2 LED6.BAR_DISPLAY1
N$14
  Top 0.406: LED6.BAR_DISPLAY2 R21.2
N$15
  Top 0.406: LED6.BAR_DISPLAY3 R22.2
N$16
  Top 0.406: LED6.BAR_DISPLAY4 R23.2
N$17
  Top 0.406: LED6.BAR_DISPLAY5 R24.2
N$18
  Top 0.406: LED6.BAR_DISPLAY6 72.73,61.98 R25.2
N$19
  Top 0.406: LED6.BAR_DISPLAY7 R26.2
N$20
  Top 0.406: LED6.BAR_DISPLAY8 72.73,56.9 R27.2
N$21
  Top 0.406: LED6.BAR_DISPLAY9 R28.2
N$22
  Top 0.305: R18.1 90.56,21.54 90.56,26.4 89.99,26.97 U3.8
N$23
  Top 0.406: R18.2 95,15.15 LED5.A
N$24
  Top 0.406: R14.2 99.06,12.19 LED1.A
N$25  (via drill 0.38 pad 0.76)
  Top 0.305: R14.1 101.85,19.77 v101.85,28.07 | v101.73,37.21 99.57,39.37 98.3,39.37 97.41,38.48 94.89,38.48 U3.22
  Bottom 0.305: v101.85,28.07 102.36,28.58 102.36,36.58 v101.73,37.21
N$27
  Top 0.305: R8.2 45.59,43.31 46.74,44.45 46.74,46.74 47.06,47.06 47.79,47.06 U2.P$5
N$28
  Top 0.305: U3.36 85.99,36.18 86.23,35.94 90.3,35.94 93.73,39.37 93.73,40 95.12,41.4 95.12,43.05 101.85,49.78 101.85,55.5 93.98,63.37 92.2,63.37 90.93,64.64 90.93,71.97 92.5,73.53 R17.1
N$29  (via drill 0.45 pad 0.76)
  Top 0.305: v90.55,35.18 90.48,35.25 82.72,35.25 U3.37 | v94.74,39.37 96.14,40.77 96.14,42.93 102.62,49.4 102.62,55.88 94.23,64.26 92.96,64.26 91.69,65.53 91.69,69.05 92.37,69.72 R16.1
  Bottom 0.305: v90.55,35.18 v94.74,39.37
N$30  (via drill 0.45 pad 0.76)
  Top 0.305: U3.38 82.72,34.45 90.13,34.45 v90.55,34.04 | v96.9,39.37 96.9,42.67 103.25,49.02 103.25,56.52 93.51,66.26 R15.1
  Bottom 0.305: v90.55,34.04 95.89,39.37 v96.9,39.37
N$31
  Top 0.305: R17.2 94.98,73.55 97.68,73.55 LED2.A
N$32
  Top 0.305: LED3.A 95.21,69.6 R16.2
N$33
  Top 0.305: R15.2 97.03,66.29 LED4.A
RST
  Top 0.254: U3.13 95.66,30.58 96.1,30.14 R13.1 101.05,30.14 102.87,28.32 102.87,19.3 101.47,17.91 101.47,4.32 J3.5
SCL  (via drill 0.45 pad 0.76)
  Top 0.254: U1.5 62.17,28.39 62.82,29.04 69.89,29.04 70.09,29.23 | 70.09,29.23 R3.1 | 70.09,29.23 71.14,29.23 v71.25,29.34 | v96.52,34.67 94.28,34.67 U3.18
  Bottom 0.254: v71.25,29.34 73.15,29.34 76.84,25.65 94.11,25.65 96.77,28.32 96.77,34.42 v96.52,34.67
SCLK
  Top 0.254: J3.3 95.76,1.14 93.73,1.14 92.96,1.91 92.96,5.97 94.36,7.37 96.14,7.37 96.77,8 96.77,16.89 91.06,22.6 91.06,26.7 90.79,26.97 U3.9
SDA  (via drill 0.38 pad 0.76, 0.45 pad 0.76)
  Top 0.254: U1.4 62.82,28.03 63.25,28.45 71.51,28.45 | 71.51,28.45 73.35,30.28 73.35,31.05 73.7,31.41 R4.1 | 71.51,28.45 v72.77,28.45 | v97.28,35.56 95.38,35.56 95.2,35.38 U3.19
  Bottom 0.254: v72.77,28.45 76.07,25.15 94.74,25.15 97.28,27.69 v97.28,35.56
SRP  (via drill 0.45 pad 0.76)
  Top 0.152: R7.1 33.91,15.88 v34.04,15.88
  Top 0.305: v61.98,15.24 62.14,15.41 C5.1 63.47,18.1 U1.18
  Bottom 0.305: v34.04,15.88 35.18,14.73 61.47,14.73 v61.98,15.24
  pour Top (isolate 0.254): 31.37,21.97 31.37,12.83 37.08,12.83 37.08,22.04 31.44,22.04
SW  (via drill 0.4 pad 0.76)
  Top 0.508: C8.2 45.89,50.55 v44.45,50.55 v43.31,50.55
  other vias: 42.16,48.13 43.18,48.13 43.18,47.12 42.16,47.12 29.08,48.01 35.31,45.97 32.13,47.5 35.31,48.01 28.96,45.97 32.26,45.85
  pour Top: 41.78,46.74 45.85,46.74 45.85,46.99 45.72,47.12 44.83,47.12 43.43,48.51 41.78,48.51
  pour Bottom (isolate 0.254): 43.56,48.64 28.07,48.64 27.69,48.26 27.69,45.85 28.19,45.34 36.2,45.34 37.46,46.61 43.43,46.61 43.69,46.86 43.69,48.51
  pour Bottom (isolate 0.254): 42.67,47.75 42.67,50.93 44.96,50.93 44.96,50.04 43.99,50.04 43.69,49.73 43.69,47.75
  pour Top: 30.1,48.64 28.07,48.64 27.69,48.26 27.69,45.85 28.19,45.34 36.2,45.34 36.45,45.59 36.45,48.26 36.07,48.64
UVCC  (via drill 0.45 pad 0.76)
  Top 0.508: U3.2 85.19,22.73 | 85.19,22.73 85.19,21.49 86.84,19.85 88.43,19.85 89.92,21.34 89.92,26.04 89.19,26.76 U3.7 | 85.19,22.73 JP6.3 83.06,21.21 C12.2 | J2.VBUS 81.15,17.3 81.15,18.8 82,19.65 C12.2 | v85.6,14.22 85.6,17.11 C12.2
  Bottom 0.508: J3.2 87.88,5.21 86.87,6.22 86.87,7.87 85.6,9.14 v85.6,14.22
VCC  (via drill 0.38 pad 0.76)
  Top 0.254: R13.2 97.46,31.38 U3.14
  Top 0.305: U3.42 79.64,31.38 79.12,30.86 78.23,30.86
  Top 0.406: v92.2,31.37 94.18,31.37 U3.14
  Top 0.508: C15.2 78.77,29.27 82.08,29.27 U3.44 | U3.24 91.59,38.57 v90.08,37.05 89.46,37.05 88.98,36.58 86.87,36.58 85.66,37.78 U3.34 79.82,37.78 77.8,35.77 77.8,31.67 78.23,31.24 78.23,30.86 78.23,28.92 C15.2 | C15.2 79.88,27.27 79.88,23.62 JP6.2
  Bottom 0.406: v90.08,37.05 90.08,36.35 89.41,35.69 89.41,33.4 89.79,33.02 90.93,33.02 92.2,31.75 v92.2,31.37
VIN
  Top 0.406: U1.10 U1.9
  Top 0.508: 53.34,26.04 D1.N 53.39,26.25 53.39,26.62
  Top 0.61: 56.26,26.62 U1.10 | C2.2 56.26,26.62 | 56.26,26.62 53.39,26.62 53.97,27.2 C1.2 | R1.1 49.95,23.75 51.05,23.75 53.34,26.04

### Text on the board
tNames: Power Distribution | Board | 100% | 5V | 5V_FG | J5 | J6 | J7 | J8 | 12V_FG | UV | Battery | L1 | 0% | Life | C7 | 5V | 12V | 3.3V | J1 | Battery | ISP | ON/OFF
bNames: (c) Pioneers In Engineering / Design by: Sherwin A and Adilet P. / This design is open source hardware. / For more information, visit / pioneers.berkeley.edu/opensource